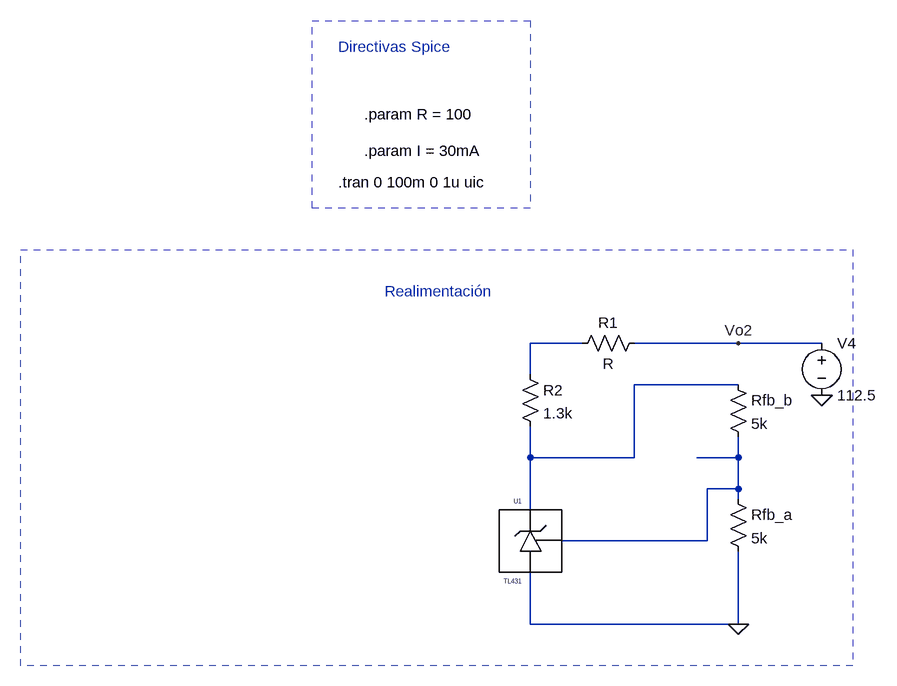
[diagram p0: schematic Testing_TL431_b.asc]
Testing_TL431_b.asc, the LTspice schematic file:
Version 4
SHEET 1 4228 2080
WIRE -912 -48 -992 -48
WIRE -672 -48 -832 -48
WIRE -544 -48 -672 -48
WIRE -992 0 -992 -48
WIRE -672 16 -832 16
WIRE -992 128 -992 80
WIRE -832 128 -832 16
WIRE -832 128 -992 128
WIRE -672 128 -672 96
WIRE -672 128 -736 128
WIRE -672 176 -672 128
WIRE -672 176 -720 176
WIRE -672 192 -672 176
WIRE -992 208 -992 128
WIRE -720 256 -720 176
WIRE -720 256 -944 256
WIRE -992 384 -992 304
WIRE -672 384 -672 272
WIRE -672 384 -992 384
FLAG -672 -48 Vo2
FLAG -672 384 0
FLAG -544 32 0
SYMBOL res -688 0 R0
SYMATTR InstName Rfb_b
SYMATTR Value 5k
SYMBOL res -688 176 R0
SYMATTR InstName Rfb_a
SYMATTR Value 5k
SYMBOL tl431 -992 256 M0
SYMATTR InstName U1
SYMBOL voltage -544 -64 R0
WINDOW 123 0 0 Left 0
WINDOW 39 0 0 Left 0
SYMATTR InstName V4
SYMATTR Value 112.5
SYMBOL res -1008 -16 R0
SYMATTR InstName R2
SYMATTR Value 1.3k
SYMBOL res -816 -64 R90
WINDOW 0 0 56 VBottom 2
WINDOW 3 32 56 VTop 2
SYMATTR InstName R1
TEXT -1288 -504 Left 2 ;Directivas Spice
TEXT -1288 -296 Left 2 !.tran 0 100m 0 1u uic
TEXT -1216 -128 Left 2 ;Realimentación
TEXT -1248 -400 Left 2 !.param R = 100
TEXT -1248 -344 Left 2 !.param I = 30mA
RECTANGLE Normal -992 -256 -1328 -544 2
RECTANGLE Normal -496 448 -1776 -192 2

The netlist it stands for:
* Testing_TL431_b.asc
Rfb_b N002 N003 5k
Rfb_a N003 0 5k
XU1 N002 0 N003 TL431  ; pins K A FDBK
V4 Vo2 0 112.5
R2 N001 N002 1.3k
R1 Vo2 N001 R
* Directivas Spice
.tran 0 100m 0 1u uic
* Realimentación
.param R = 100
.param I = 30mA
.lib TL431.sub
.backanno
.end